# EAGLE design MIDIWing (EAGLE 5.06)
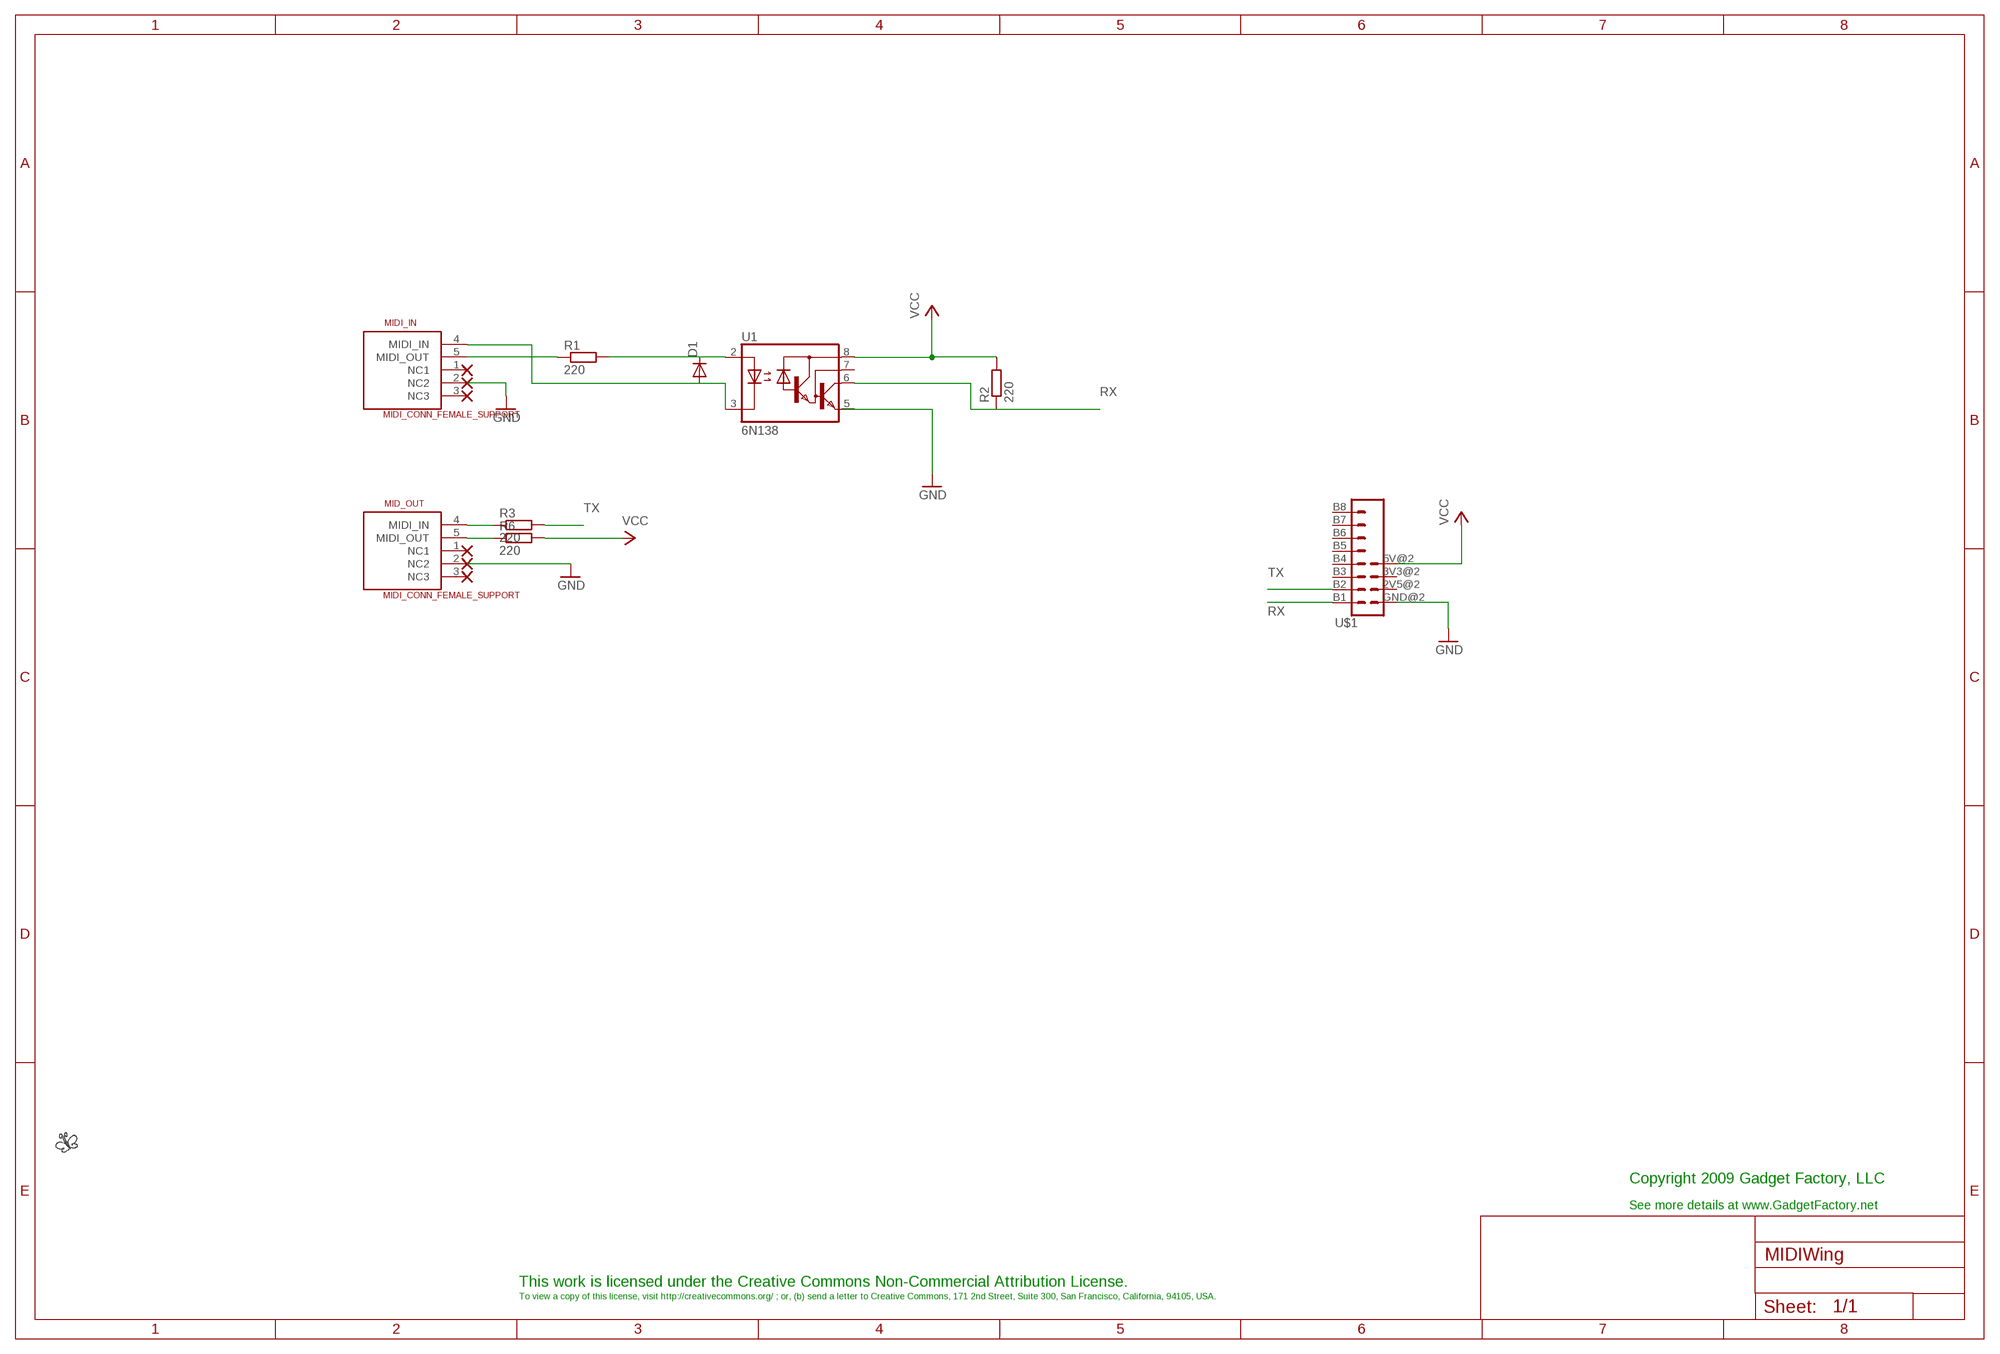
[diagram p0: schematic, sheet 1]

## Parts
D1  DIODE1N4148  [DIODE-1N4148]
LOGO2  BUTTERFLY_LOGO  [BUTTERFLY_LOGO]
MID_OUT  MIDI_CONN_FEMALE_SUPPORT  [DIN_5_FEMALE_SUPPORT]
MIDI_IN  MIDI_CONN_FEMALE_SUPPORT  [DIN_5_FEMALE_SUPPORT]
R1  220  R-EU_0204/7  [0204/7]
R2  220  R-EU_0204/7  [0204/7]
R3  220  R-EU_0204/7  [0204/7]
R6  220  R-EU_0204/7  [0204/7]
U1  6N138  [DIL08]
U$1  WING_8BIT  [WINGSIDE_8BIT]

## Nets
GND: MID_OUT.2(NC2) MIDI_IN.2(NC2) U1.5(GND) U$1.GND@2(GND)
N$2: D1.A MIDI_IN.4(MIDI_IN) U1.3(C)
N$3: D1.C R1.2 U1.2(A)
N$4: MIDI_IN.5(MIDI_OUT) R1.1
N$5: MID_OUT.4(MIDI_IN) R3.1
N$7: MID_OUT.5(MIDI_OUT) R6.1
RX: R2.1 U1.6(VO) U$1.B1
TX: R3.2 U$1.B2
VCC: R2.2 R6.2 U1.8(VCC) U$1.5V@2(5V)
Unconnected: MID_OUT.1(NC1) MID_OUT.3(NC3) MIDI_IN.1(NC1) MIDI_IN.3(NC3) U1.7(VB) U$1.2V5@2(2V5) U$1.3V3@2(3V3) U$1.B3 U$1.B4 U$1.B5 U$1.B6 U$1.B7 U$1.B8

## Notes on the sheet
- Copyright 2009 Gadget Factory, LLC
- See more details at www.GadgetFactory.net
- This work is licensed under the Creative Commons Non-Commercial Attribution License.
- To view a copy of this license, visit http://creativecommons.org/ ; or, (b) send a letter to Creative Commons, 171 2nd Street, Suite 300, San Francisco, California, 94105, USA.

## Library data of the parts
D1 = SparkFun:DIODE: Diode These are standard reverse protection diodes and small signal diodes. SMA package can handle up to about 1A. SOD-323 can handle about 200mA. What the SOD-323 package when ordering, there are some mfgs out there that are 5-pin packages.
LOGO2 = GadgetFactory_Pub:BUTTERFLY_LOGO
MID_OUT MIDI_IN = SparkFun:MIDI_CONN_FEMALE_SUPPORT
R1-R3 R6 = rcl:R-EU_: RESISTOR, European symbol
U1 = optocoupler:6N138: MOTOROLA OPTO COUPLER
U$1 = GadgetFactory_Pub:WING_8BIT

## Board
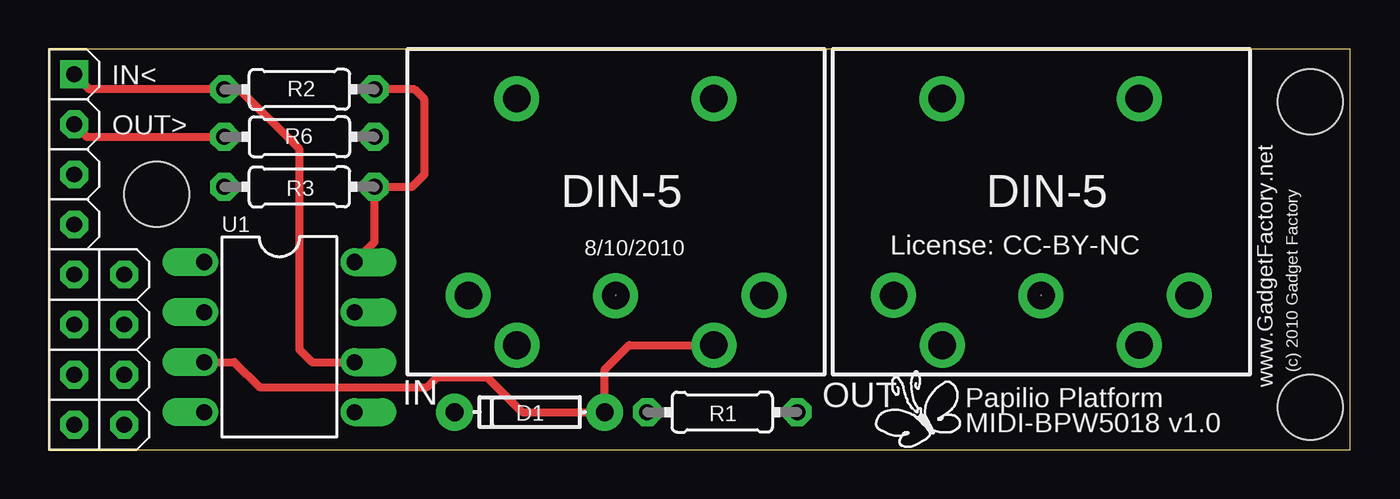
[diagram p1: board, top side]
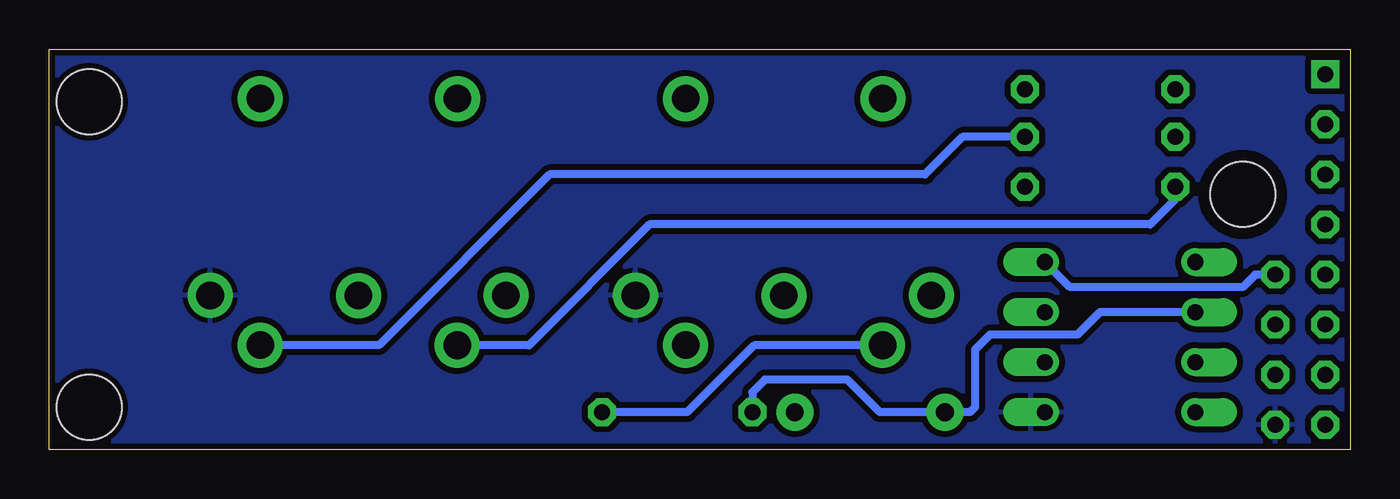
[diagram p2: board, bottom side, seen from below]

Size 66.04 x 20.32 mm. Coordinates in mm from the lower left corner, seen from the top.
Outline: 0,0 66.04,0 66.04,20.32 0,20.31 0,0
Copper layers (1*16): Top 0.035mm / dielectric 1.5mm / Bottom 0.035mm
Design rules "SparkFun_Derived_GoldePheonix_10mil": minimum track width 10mil, minimum drill 15mil, track to track 8mil, track to pad 8mil, pad to pad 8mil, via to via 8mil, smd to smd 8mil, copper to edge 10mil, drill to drill 8mil, minimum pad ring 12mil, minimum via ring 10mil, stop-mask expansion 4mil, vias tented up to drill 18mil, thermal gap 10mil
Holes 3.3 mm at 64.01,2.16 64.01,17.65

### Footprints (pad centres in the part's own frame; a part is rotated, then mirrored left to right if it is on the bottom)
DIODE-1N4148 = drill 0.9 pad 1.88 round: A -3.81,0; C 3.81,0
DIN_5_FEMALE_SUPPORT = drill 1.4 pad 2.286 round: 1 0.46,3.61; 2 -7.07,3.6; 3 7.94,3.6; 4 -4.53,6.12; 5 5.47,6.13; 6 -4.53,-6.382; 7 5.478,-6.382
0204/7 = drill 0.813 octagon: 1 -3.81,0; 2 3.81,0
DIL08 = drill 0.813 offset: 1 -3.81,-3.81; 2 -1.27,-3.81; 3 1.27,-3.81; 4 3.81,-3.81; 5 3.81,3.81; 6 1.27,3.81; 7 -1.27,3.81; 8 -3.81,3.81
WINGSIDE_8BIT = drill 0.8 octagon: 2V5@2 16.51,3.81; 3V3@2 13.97,3.81; 5V@2 11.43,3.81; B2 3.81,1.27; B3 6.35,1.27; B4 8.89,1.27; B5 11.43,1.27; B6 13.97,1.27; B7 16.51,1.27; B8 19.05,1.27; GND@2 19.05,3.81 | drill 0.8 square: B1 1.27,1.27 | hole 3.302: 7.366,5.461

### Placement (x,y rotation side)
D1  24.38,1.91 180 top
LOGO2  44.2,1.52 0 top
MID_OUT  50.8,11.43 180 top
MIDI_IN  29.21,11.43 180 top
R1  34.16,1.91 180 top
R2  12.7,18.29 0 top
R3  12.7,15.88 180 top
R6  12.7,13.34 0 top
U1  11.68,5.71 270 top
U$1  0,20.32 270 top

### Tracks (layer width: path | path; a pad name or v marks a point on that pad's centre or on a via)
GND
  pour Bottom (isolate 0.305): 0,20.32 66.04,20.32 66.04,0 0,0
N$2
  Top 0.406: U1.3 9.4,4.45 10.67,3.17 19.18,3.17 19.68,3.68 22.23,3.68 24,1.91 D1.A 28.19,4.06 29.44,5.31 MIDI_IN.4
N$3
  Bottom 0.406: U1.2 12.7,6.99 13.84,5.84 18.29,5.84 19.05,5.08 19.05,2.16 19.3,1.91 D1.C | D1.C 20.95,1.91 | R1.2 30.35,2.92 29.72,3.56 25.53,3.56 23.88,1.91 D1.C
N$4
  Bottom 0.406: MIDI_IN.5 30.26,5.3 33.66,1.91 R1.1
N$5
  Bottom 0.406: R3.1 19.68,15.88 21.59,13.97 40.64,13.97 49.3,5.31 MID_OUT.4
N$7
  Bottom 0.406: R6.1 8.89,12.7 10.16,11.43 35.56,11.43 41.69,5.3 MID_OUT.5
RX
  Top 0.406: U$1.B1 2.03,18.29 R2.1 9.65,18.29 12.7,15.24 12.7,5.08 13.34,4.45 U1.6
TX
  Top 0.406: R3.2 1.91,15.88 U$1.B2
VCC
  Top 0.406: R2.2 18.54,18.29 19.05,17.78 19.05,13.97 18.41,13.34 R6.2 16.51,10.54 U1.8
  Bottom 0.406: U$1.5V@2 4.83,8.89 5.46,8.26 14.22,8.26 U1.8

### Text on the board
tPlace: IN< | OUT> | 8/10/2010 | License: CC-BY-NC | (c) 2010 Gadget Factory | www.GadgetFactory.net | IN | OUT | Papilio Platform | MIDI-BPW5018 v1.0